# EAGLE design cansat (EAGLE 9.6.2)
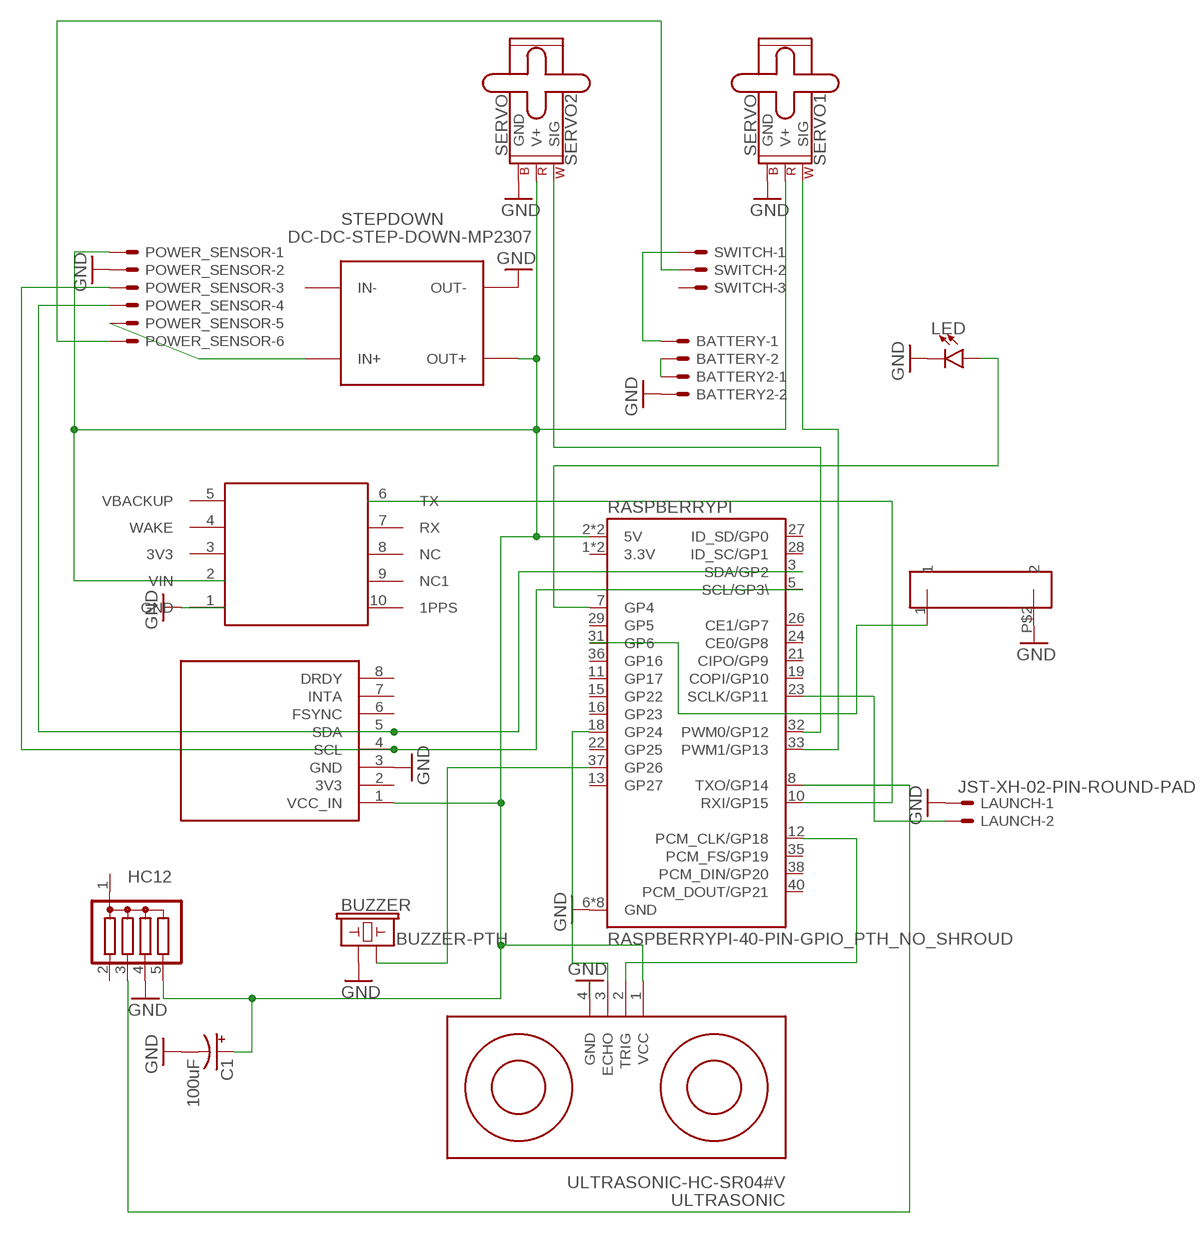
[diagram p0: schematic, sheet 1]

## Parts
BATTERY  JST-XH-02-PIN-ROUND-PAD  [JST-XH-02-PACKAGE-ROUND-PAD]
BATTERY2  JST-XH-02-PIN-ROUND-PAD  [JST-XH-02-PACKAGE-ROUND-PAD]
BUZZER  BUZZER-PTH  [BUZZER-12MM]
C1  100uF  100UF-POLAR-RADIAL-2.5MM-25V-20%  [CPOL-RADIAL-2.5MM-6.5MM]
GPS  AIR530  [AIR530FOOTPRINT]
HC12  G04R  [SIL5]
LAUNCH  JST-XH-02-PIN-ROUND-PAD  [JST-XH-02-PACKAGE-ROUND-PAD]
LED  LED5MM  [LED_5MM]
MPU  GY-86  [GY-86]
POWER_SENSOR  JST-XH-06-PIN-ROUND-PAD  [JST-XH-06-PACKAGE-ROUND-PAD]
RASPBERRYPI  RASPBERRYPI-40-PIN-GPIO_PTH_NO_SHROUD  [2X20]
SENSOR  PENCIL  [PENCIL]
SERVO1  SERVO  [1X03]
SERVO2  SERVO  [1X03]
STEPDOWN  DC-DC-STEP-DOWN-MP2307  [DC-DC-STEP-DOWN-MP2307]
SWITCH  JST-XH-03-PIN-ROUND-PAD  [JST-XH-03-PACKAGE-ROUND-PAD]
ULTRASONIC  ULTRASONIC-HC-SR04#V  [ULTRASONIC-HC-SR04#V]

## Nets
GND: BATTERY2.2 BUZZER.+ C1.2(-) GPS.1(GND) HC12.4 LAUNCH.1 LED.K(C) MPU.3(GND) POWER_SENSOR.2 RASPBERRYPI.6(GND) RASPBERRYPI.9(GND) RASPBERRYPI.14(GND) RASPBERRYPI.20(GND) RASPBERRYPI.25(GND) RASPBERRYPI.30(GND) RASPBERRYPI.34(GND) RASPBERRYPI.39(GND) SENSOR.P$2 SERVO1.3(GND) SERVO2.3(GND) STEPDOWN.OUT- ULTRASONIC.4(GND)
N$1: C1.1(+) GPS.2(VIN) HC12.5 MPU.1(VCC_IN) POWER_SENSOR.1 RASPBERRYPI.2(5V) RASPBERRYPI.4(5V) SERVO1.2(V+) SERVO2.2(V+) STEPDOWN.OUT+ ULTRASONIC.1(VCC)
N$2: LED.A RASPBERRYPI.7(GP4)
N$3: BATTERY2.1 BATTERY.2
N$4: BATTERY.1 SWITCH.1
N$5: POWER_SENSOR.6 SWITCH.2
N$6: GPS.6(TX) RASPBERRYPI.10(RXI/GP15)
N$7: HC12.3 RASPBERRYPI.8(TXO/GP14)
N$8: MPU.5(SDA) POWER_SENSOR.4 RASPBERRYPI.3(SDA/GP2)
N$9: MPU.4(SCL) POWER_SENSOR.3 RASPBERRYPI.5(SCL/GP3\)
N$10: RASPBERRYPI.12(PCM_CLK/GP18) ULTRASONIC.2(TRIG)
N$11: RASPBERRYPI.18(GP24) ULTRASONIC.3(ECHO)
N$12: RASPBERRYPI.32(PWM0/GP12) SERVO2.1(SIG)
N$13: RASPBERRYPI.33(PWM1/GP13) SERVO1.1(SIG)
N$14: BUZZER.- RASPBERRYPI.37(GP26)
N$16: LAUNCH.2 RASPBERRYPI.23(SCLK/GP11)
N$17: POWER_SENSOR.5 STEPDOWN.IN+
N$18: RASPBERRYPI.31(GP6) SENSOR.1
Unconnected: GPS.3(3V3) GPS.4(WAKE) GPS.5(VBACKUP) GPS.7(RX) GPS.8(NC) GPS.9(NC1) GPS.10(1PPS) HC12.1 HC12.2 MPU.2(3V3) MPU.6(FSYNC) MPU.7(INTA) MPU.8(DRDY) RASPBERRYPI.11(GP17) RASPBERRYPI.13(GP27) RASPBERRYPI.15(GP22) RASPBERRYPI.16(GP23) RASPBERRYPI.19(COPI/GP10) RASPBERRYPI.21(CIPO/GP9) RASPBERRYPI.22(GP25) RASPBERRYPI.24(CE0/GP8) RASPBERRYPI.26(CE1/GP7) RASPBERRYPI.27(ID_SD/GP0) RASPBERRYPI.28(ID_SC/GP1) RASPBERRYPI.29(GP5) RASPBERRYPI.35(PCM_FS/GP19) RASPBERRYPI.36(GP16) RASPBERRYPI.38(PCM_DIN/GP20) RASPBERRYPI.40(PCM_DOUT/GP21) STEPDOWN.IN- SWITCH.3

## Power pins joined to a net without a drawn wire
3.3V: RASPBERRYPI.1(3.3V) RASPBERRYPI.17(3.3V)

## Library data of the parts
BATTERY BATTERY2 LAUNCH = Rembrandt Electronics - JST XH Connectors v1-0:JST-XH-02-PIN: JST XH Connector 2 Pin Wire to board connector. Pitch: 2,54 mm, (0.100") Number of pins: 2 Created by Rembrandt Electronics www.rembrandtelectronics.com
BUZZER = SparkFun-Electromechanical:BUZZER: Buzzer Small round buzzers that operate around the audible 2kHz range. You can use these as speakers to create simple music or user interfaces. Variant Overview: PTH - Mini Speaker - PC Mount 12mm 2.048kHz <https://www.sparkfun.com/products/7950> PTH_KIT - Mini Speaker - PC Mount 12mm 2.048kHz <https://www.sparkfun.com/products/7950> KIT simplifies soldering by adding stop mask to one side of the pads. PTH_NO_SILK - Mini Speaker - PC Mount 12mm 2.048kHz <https://www.sparkfun.com/products/7950> No silkscreen indicator of buzzer outline. PTH_KIT_NO_SILK - Mini Speaker - PC Mount 12mm 2.048kHz <https://www.sparkfun.com/products/7950> KIT package w/o silkscreen SMD - Buzzer Audio Magnetic (CCV-084B16) SMD buzzer used on, e.g. the LilyPad Buzzer <https://www.sparkfun.com/products/8463> and RFID USB Reader <https://www.sparkfun.com/products/9963>. SMD_KIT - Buzzer Audio Magnetic (CCV-084B16) SMD Buzzer with elongated pins to make soldering easier. Used on the SparkFun Simon Says - Surface Mount Soldering Kit <https://www.sparkfun.com/products/10935>.; PROD_ID: COMP-08253; SF_SKU: COM-07950
C1 = SparkFun-Capacitors:100UF-POLAR: 100µF polarized capacitors A capacitor is a passive two-terminal electrical component used to store electrical energy temporarily in an electric field.; PROD_ID: CAP-08439
GPS = air530:AIR530
HC12 = resistor-sil:G04R: SIL RESISTOR; OC_FARNELL: unknown; OC_NEWARK: unknown
LED = SparkFun-LED:LED: LED (Generic) Standard schematic elements and footprints for 5mm, 3mm, 1206, and 0603 sized LEDs. Generic LEDs with no color specified.
MPU = gy91:GY-86
POWER_SENSOR = Rembrandt Electronics - JST XH Connectors v1-0:JST-XH-06-PIN: JST XH Connector 2 Pin Wire to board connector. Pitch: 2,54 mm, (0.100") Number of pins: 6 Created by Rembrandt Electronics www.rembrandtelectronics.com
RASPBERRYPI = SparkFun-Connectors:RASPBERRYPI-40-PIN-GPIO: Raspberry Pi GPIO Header 2x20 pin connector, as found on B, B+, A+ models. Both shrouded PTH and SMT versions available. SparkFun Products: GPIO Shrouded Header <https://www.sparkfun.com/products/13054>- PTH SparkFun Pi Wedge (Preassembled) <https://www.sparkfun.com/products/13717>
SENSOR = pencil:PENCIL
SERVO1 SERVO2 = SparkFun-Electromechanical:SERVO: Servo Motor 3-pin connector for a standard servo motor (voltage supply, ground, and control signal.) SparkFun Products Servo - Generic (Sub-Micro Size) <https://www.sparkfun.com/products/9065> (ROB-09065) Servo - Generic High Torque Continuous Rotation (Standard Size) <https://www.sparkfun.com/products/9347> (ROB-09347) Servo - Generic High Torque (Standard Size) <https://www.sparkfun.com/products/11965> (ROB-11965)
STEPDOWN = diy-modules:DC-DC-STEP-DOWN-MP2307: DC/DC Step-Down Regulator based on MP2307DN chip MP2307 datasheet available here: https://cdn-shop.adafruit.com/datasheets/MP2307_r1.9.pdf Click here to find device on ebay.com <http://www.ebay.com/sch/dc+dc+3a+mini+converter>
SWITCH = Rembrandt Electronics - JST XH Connectors v1-0:JST-XH-03-PIN: JST XH Connector 2 Pin Wire to board connector. Pitch: 2,54 mm, (0.100") Number of pins: 3 Created by Rembrandt Electronics www.rembrandtelectronics.com
ULTRASONIC = diy-modules:ULTRASONIC-HC-SR04: Ultrasonic Ranging Module HC-SR04 More details available here: http://randomnerdtutorials.com/complete-guide-for-ultrasonic-sensor-hc-sr04/ Click here to find device on ebay.com <http://www.ebay.com/sch/hc+sr04+ultrasonic>

## Board
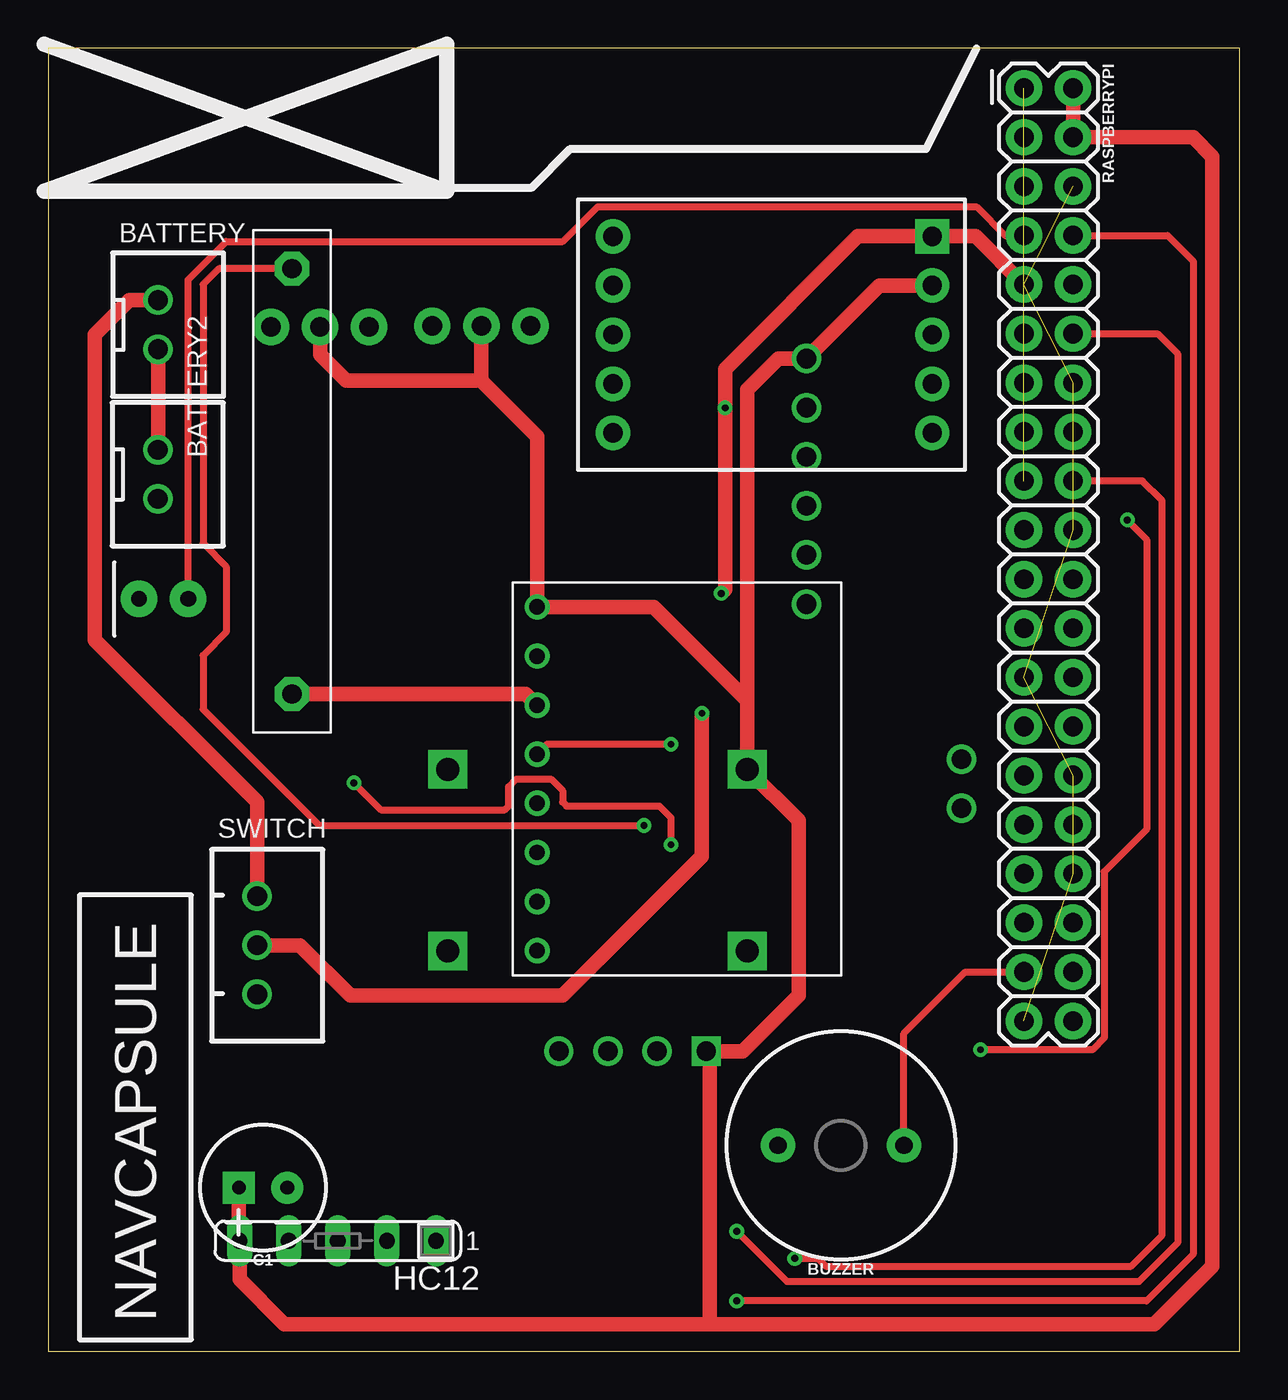
[diagram p1: board, top side]
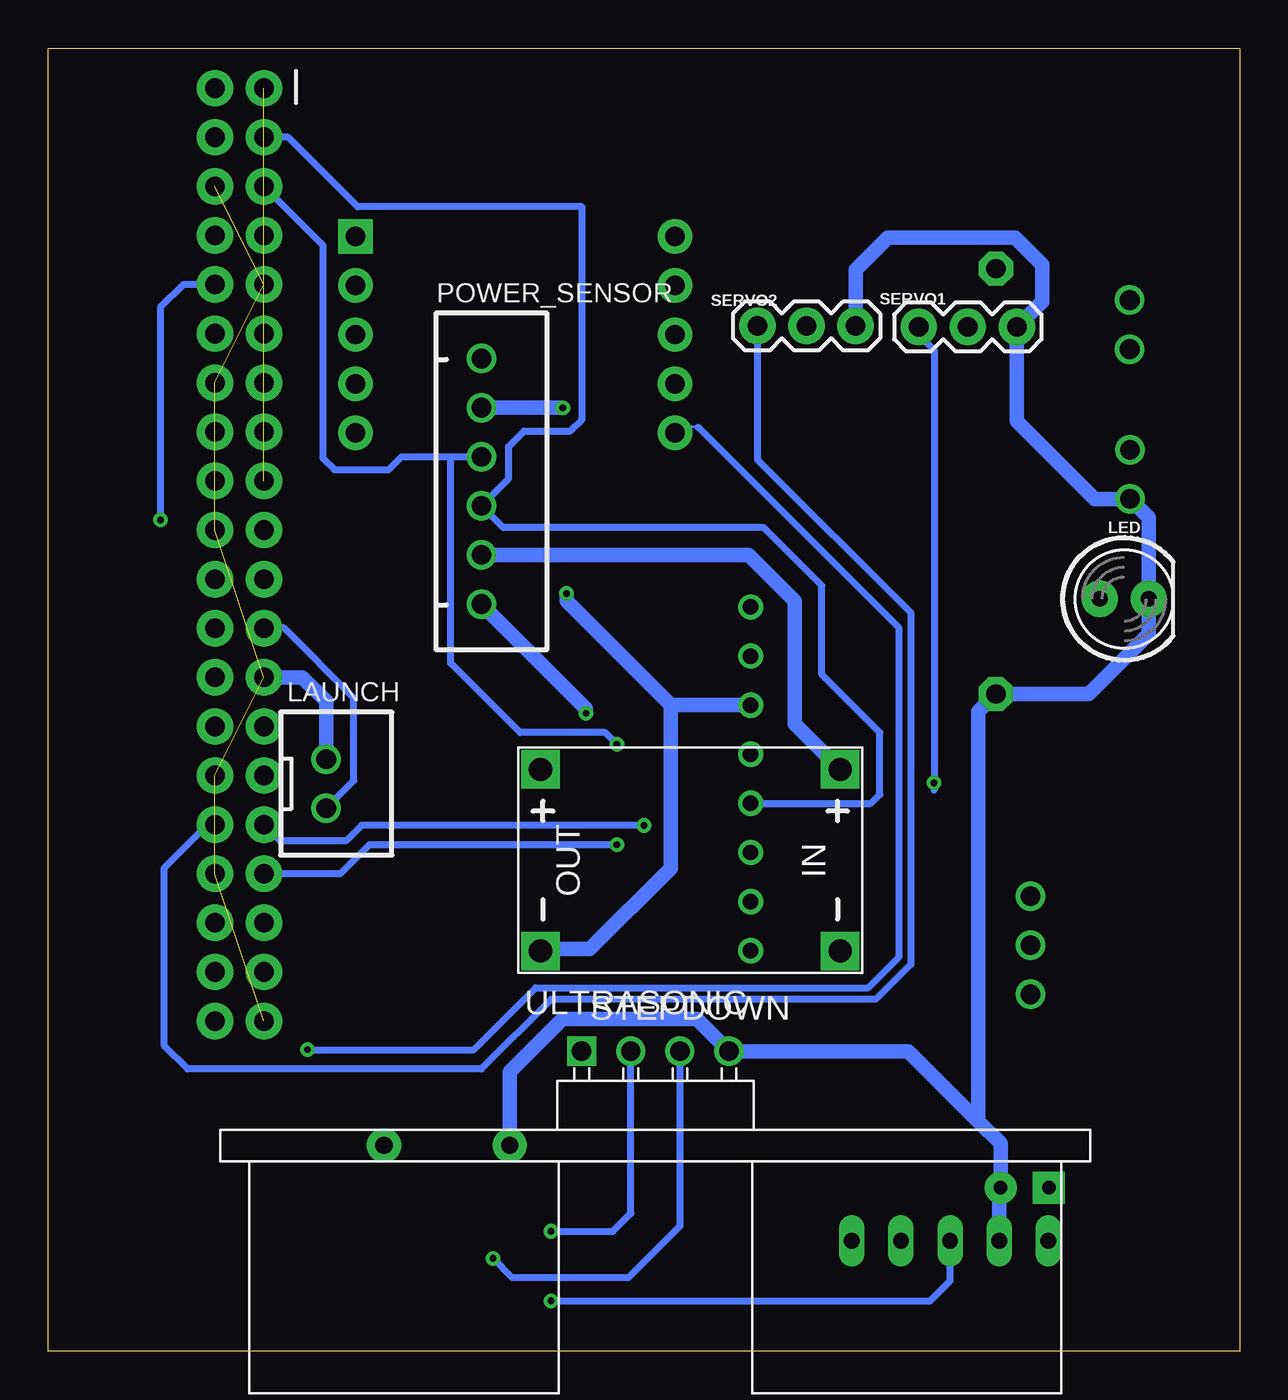
[diagram p2: board, bottom side, seen from below]

Size 61.6 x 67.4 mm. Coordinates in mm from the lower left corner, seen from the top.
Outline: 0,0 61.6,0 61.6,67.4 0,67.4 0,0
Copper layers (1*16): Top 0.035mm / dielectric 1.08mm / Bottom 0.035mm
Design rules "default *": minimum track width 6mil, minimum drill 0.35mm, track to track 6mil, track to pad 6mil, pad to pad 6mil, via to via 6mil, smd to smd 6mil, copper to edge 40mil, drill to drill 6mil, minimum pad ring 10mil, minimum via ring 8mil, stop-mask expansion 4mil, vias tented up to drill 0mil, thermal gap 10mil

### Footprints (pad centres in the part's own frame; a part is rotated, then mirrored left to right if it is on the bottom)
JST-XH-02-PACKAGE-ROUND-PAD = drill 1.016: 1 -1.27,0; 2 1.27,0
BUZZER-12MM = drill 0.9 pad 1.778: + 3.25,0; - -3.25,0
CPOL-RADIAL-2.5MM-6.5MM = drill 0.7 pad 1.651 square: 1 1.25,0 | drill 0.7 pad 1.651: 2 -1.25,0
AIR530FOOTPRINT = drill 1 pad 1.778 square: 1 3.81,5.08 | drill 1 pad 1.778: 2 3.81,2.54; 3 3.81,0; 4 3.81,-2.54; 5 3.81,-5.08; 6 -12.7,-5.08; 7 -12.7,-2.54; 8 -12.7,0; 9 -12.7,2.54; 10 -12.7,5.08
SIL5 = drill 0.813 long: 1 -5.08,0; 2 -2.54,0; 3 0,0; 4 2.54,0; 5 5.08,0
LED_5MM = drill 0.813 pad 1.88: A -1.27,0; K 1.27,0
GY-86 = drill 0.8: 1 1.27,19.05; 2 1.27,16.51; 3 1.27,13.97; 4 1.27,11.43; 5 1.27,8.89; 6 1.27,6.35; 7 1.27,3.81; 8 1.27,1.27
JST-XH-06-PACKAGE-ROUND-PAD = drill 1.016: 1 -6.35,0; 2 -3.81,0; 3 -1.27,0; 4 1.27,0; 5 3.81,0; 6 6.35,0
2X20 = drill 1.016 pad 1.88: 1 0,0; 2 0,2.54; 3 2.54,0; 4 2.54,2.54; 5 5.08,0; 6 5.08,2.54; 7 7.62,0; 8 7.62,2.54; 9 10.16,0; 10 10.16,2.54; 11 12.7,0; 12 12.7,2.54; 13 15.24,0; 14 15.24,2.54; 15 17.78,0; 16 17.78,2.54; 17 20.32,0; 18 20.32,2.54; 19 22.86,0; 20 22.86,2.54; 21 25.4,0; 22 25.4,2.54; 23 27.94,0; 24 27.94,2.54; 25 30.48,0; 26 30.48,2.54; 27 33.02,0; 28 33.02,2.54; 29 35.56,0; 30 35.56,2.54; 31 38.1,0; 32 38.1,2.54; 33 40.64,0; 34 40.64,2.54; 35 43.18,0; 36 43.18,2.54; 37 45.72,0; 38 45.72,2.54; 39 48.26,0; 40 48.26,2.54
PENCIL = drill 1 pad 1.778 octagon: 1 0,11; P$2 0,-11
1X03 = drill 1.016 pad 1.88: 1 0,0; 2 2.54,0; 3 5.08,0
DC-DC-STEP-DOWN-MP2307 = drill 1.2 pad 2 square: IN+ -7.747,-4.699; IN- -7.747,4.699; OUT+ 7.747,-4.699; OUT- 7.747,4.699
JST-XH-03-PACKAGE-ROUND-PAD = drill 1.016: 1 -2.54,0; 2 0,0; 3 2.54,0
ULTRASONIC-HC-SR04#V = drill 1 square: 1 -3.81,0 | drill 1: 2 -1.27,0; 3 1.27,0; 4 3.81,0

### Placement (x,y rotation side)
BATTERY  5.68,53.11 270 top
BATTERY2  5.66,45.36 270 top
BUZZER  40.99,10.65 180 top
C1  11.11,8.45 180 top
GPS  41.9,52.59 0 top
HC12  14.97,5.71 180 top
LAUNCH  47.23,29.36 270 bottom
LED  5.96,38.92 0 bottom
MPU  24.01,19.45 0 top
POWER_SENSOR  39.2,45 270 bottom
RASPBERRYPI  50.45,65.34 270 top
SENSOR  12.6,45 0 top
SERVO1  16.59,52.99 0 bottom
SERVO2  24.93,53.04 0 bottom
STEPDOWN  28.4,25.4 180 bottom
SWITCH  10.8,21 270 top
ULTRASONIC  30.21,15.52 0 bottom

### Tracks (layer width: path | path; a pad name or v marks a point on that pad's centre or on a via)
3.3V  (1 unrouted)
GND  (via drill 0.35)  (7 unrouted)
  Top 0.762: RASPBERRYPI.9 47.96,57.67 GPS.1 41.87,57.67 35,50.8 v35,48.8 35,39.4 v34.8,39.2 | SENSOR.P$2 24.7,34 MPU.3
  Bottom 0.762: SERVO2.3 19.85,55.95 18.2,57.6 11.6,57.6 10.2,56.2 10.2,54.3 SERVO1.3 11.51,48.11 7.49,44.09 BATTERY2.2 4.69,43.12 LED.K 4.69,37.11 7.8,34 SENSOR.P$2 13.5,33.1 13.5,11.9 | MPU.3 29.42,33.42 | v34.8,39.2 34.8,38.8 29.42,33.42 | STEPDOWN.OUT- 36.05,20.8 33.6,20.8 29.42,24.98 29.42,33.42 | LAUNCH.1 47.23,33.57 47.2,33.6 48.46,34.86 RASPBERRYPI.25 | BUZZER.+ 37.74,14.45 34.99,17.2 28.08,17.2 ULTRASONIC.4 17.12,15.52 13.5,11.9 | 13.5,11.9 12.36,10.76 C1.2 12.43,8.38 HC12.4 | v35,48.8 v35.01,48.81 POWER_SENSOR.2
N$1
  Top 0.762: RASPBERRYPI.2 RASPBERRYPI.4 59.2,62.8 60.2,61.8 60.2,4.4 57.2,1.4 34.2,1.4 | 34.2,1.4 12.2,1.4 9.89,3.71 HC12.5 9.86,5.75 C1.1 | 34.2,1.4 34.2,15.34 ULTRASONIC.1 35.92,15.52 38.8,18.4 38.8,27.45 STEPDOWN.OUT+ 36.15,33.65 | 36.15,33.65 31.3,38.5 MPU.1 25.28,47.32 22.39,50.21 | SERVO2.2 22.39,50.21 | 22.39,50.21 15.39,50.21 14.05,51.55 SERVO1.2 | 36.15,33.65 36.15,49.75 37.75,51.35 POWER_SENSOR.1 42.98,55.13 GPS.2
N$2
  Top 0.356: LED.A 7.23,55.43 9.2,57.4 26.6,57.4 28.4,59.2 48,59.2 49.48,57.72 RASPBERRYPI.7
N$3
  Top 0.762: BATTERY.2 5.68,46.65 BATTERY2.1
N$4
  Top 0.762: SWITCH.1 10.8,28.4 2.4,36.8 2.4,52.6 4.18,54.38 BATTERY.1
N$5  (via drill 0.35)
  Top 0.762: SWITCH.2 13,21 15.6,18.4 26.6,18.4 33.8,25.6 v33.8,33
  Bottom 0.762: v33.8,33 33.8,33.25 POWER_SENSOR.6
N$6  (via drill 0.35)
  Top 0.356: v55.8,43 56.8,42 56.8,27 54.6,24.8 54.6,16.2 54,15.6 v48.2,15.6
  Bottom 0.152: 28,47.8 28.91,47.8 GPS.6
  Bottom 0.356: RASPBERRYPI.10 54.62,55.18 55.8,54 v55.8,43 | v48.2,15.6 39.6,15.6 36.4,18.8 19.2,18.8 17.6,20.4 17.6,37.4 28,47.8
N$7  (via drill 0.35)
  Top 0.356: RASPBERRYPI.8 57.88,57.72 59.2,56.4 59.2,5 56.8,2.6 v35.6,2.6
  Bottom 0.356: v35.6,2.6 16,2.6 14.97,3.63 HC12.3
N$8
  Bottom 0.356: RASPBERRYPI.3 49.2,62.8 45.6,59.2 34,59.2 34,48.2 34.6,47.6 37,47.6 37.8,46.8 37.8,45.13 POWER_SENSOR.4 38.07,42.6 24.6,42.6 21.6,39.6 21.6,35 18.6,32 18.6,28.8 19.06,28.34 MPU.5
N$9  (via drill 0.35)
  Top 0.356: MPU.4 25.8,31.4 v32.2,31.4
  Bottom 0.356: RASPBERRYPI.5 47.4,57.21 47.4,46.2 46.8,45.6 44,45.6 43.33,46.27 40.8,46.27 | 40.8,46.27 POWER_SENSOR.3 | v32.2,31.4 32.8,32 37.2,32 40.8,35.6 40.8,46.27
N$10  (via drill 0.35)
  Top 0.356: RASPBERRYPI.12 57.36,52.64 58.4,51.6 58.4,5.6 56.4,3.6 38.2,3.6 v35.6,6.2
  Bottom 0.356: v35.6,6.2 32.4,6.2 31.48,7.12 ULTRASONIC.2
N$11  (via drill 0.35)
  Top 0.356: v38.6,4.8 39.8,4.8 40.2,4.4 56,4.4 57.6,6 57.6,44 56.58,45.02 RASPBERRYPI.18
  Bottom 0.356: ULTRASONIC.3 28.94,6.46 31.6,3.8 37.6,3.8 v38.6,4.8
N$12
  Bottom 0.356: SERVO2.1 24.93,46.13 17,38.2 17,20 18.8,18.2 35.6,18.2 39.2,14.6 54.4,14.6 55.6,15.8 55.6,25 53.36,27.24 RASPBERRYPI.32
N$13  (via drill 0.35)
  Top 0.356: v15.8,29.4 17.2,28 23.6,28 23.8,28.2 23.8,29.2 24.2,29.6 26,29.6 26.6,29 26.6,28.4 26.8,28.2 31.6,28.2 32.2,27.6 v32.2,26.2
  Bottom 0.356: v15.8,29.4 15.8,29.02 15.79,29.01 15.79,51.79 16.59,52.59 SERVO1.1 | v32.2,26.2 45,26.2 46.5,24.7 RASPBERRYPI.33
N$14
  Top 0.356: BUZZER.- 44.24,16.44 47.42,19.62 RASPBERRYPI.37
N$16
  Bottom 0.356: LAUNCH.2 45.8,29.52 45.8,33.8 49.4,37.4 RASPBERRYPI.23
N$17
  Bottom 0.762: STEPDOWN.IN+ 23,32.45 23,38.8 25.39,41.19 POWER_SENSOR.5
N$18  (via drill 0.35)
  Top 0.356: SENSOR.1 8.8,56 8,55.2 8,41.8 9.2,40.6 9.2,37.2 8,36 8,33.2 14,27.2 v30.8,27.2
  Bottom 0.356: v30.8,27.2 45.4,27.2 46.2,26.4 49.61,26.4 RASPBERRYPI.31

### Text on the board
tNames: NAVCAPSULE